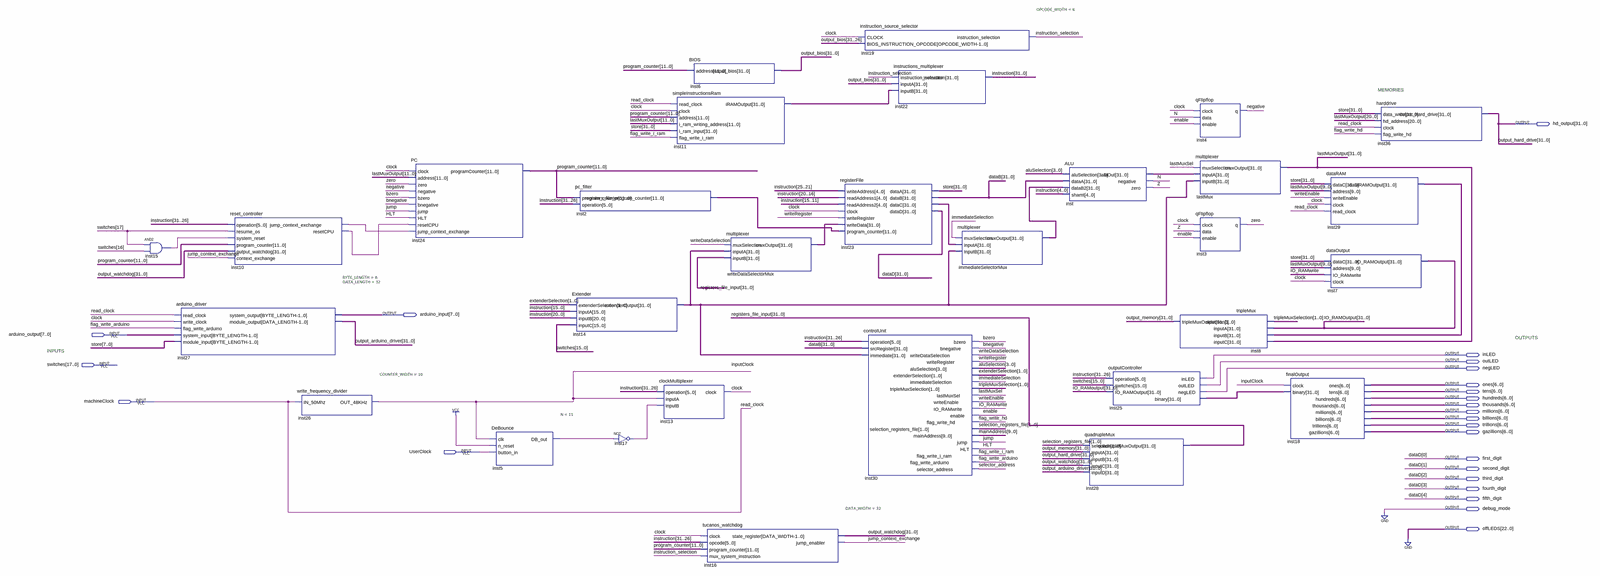
[diagram p0: schematic sheet, whole]
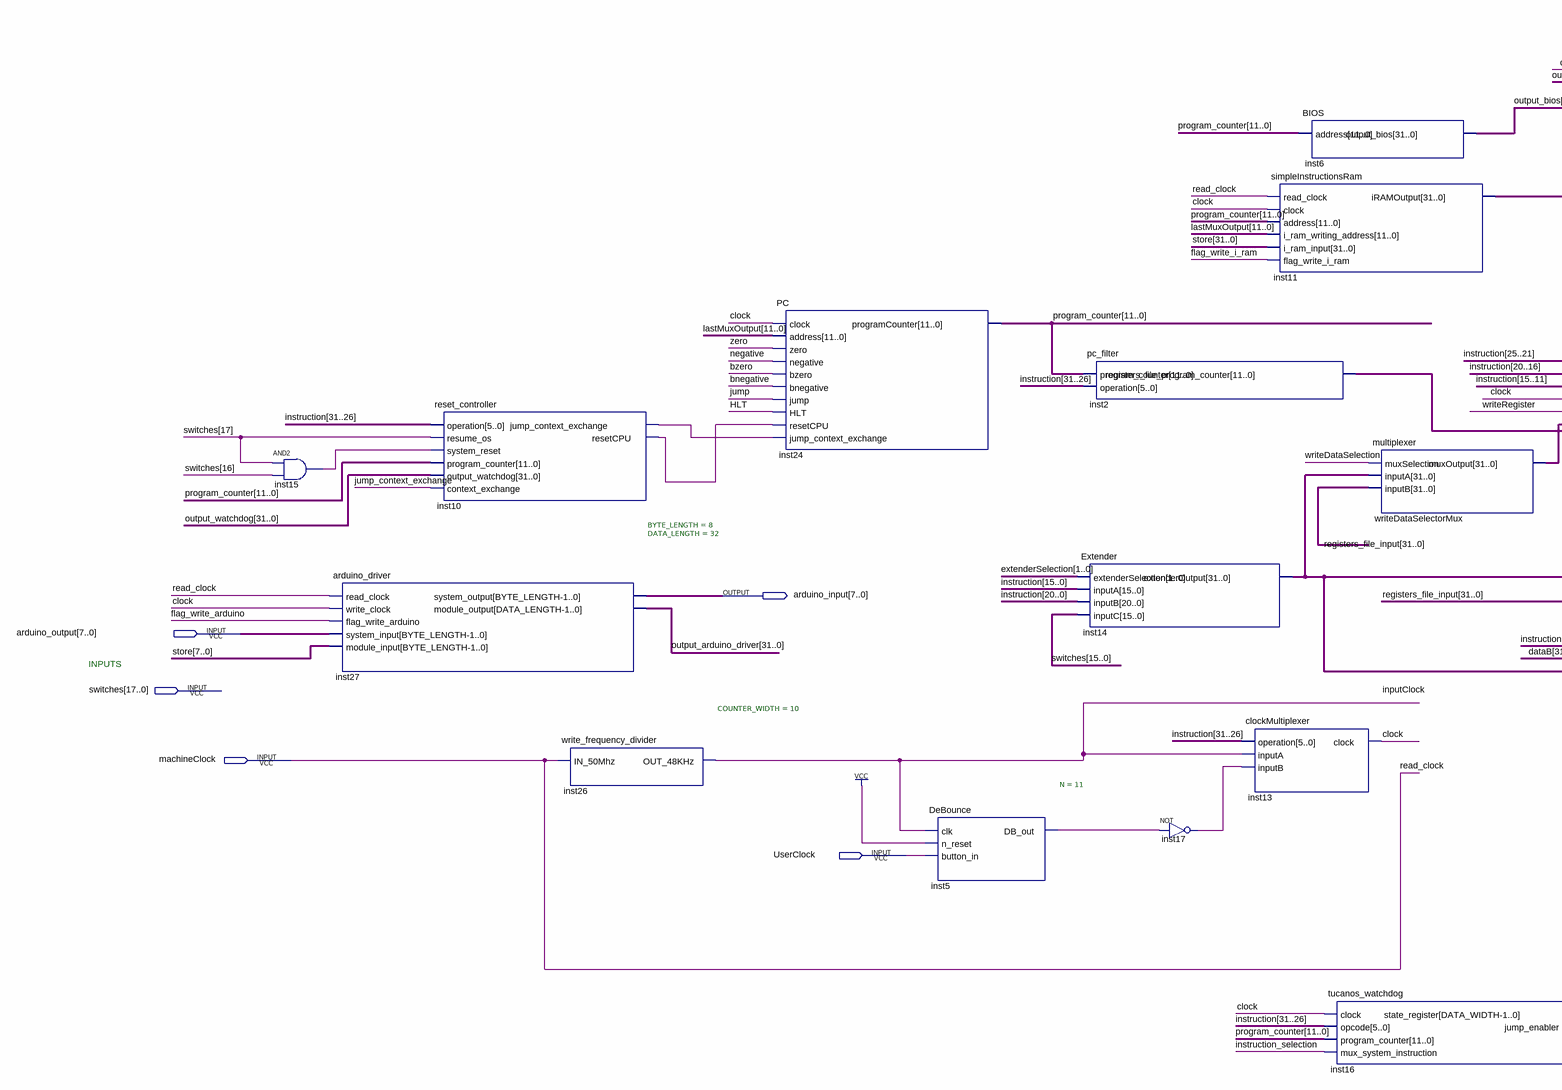
[diagram p1: schematic sheet, left part]
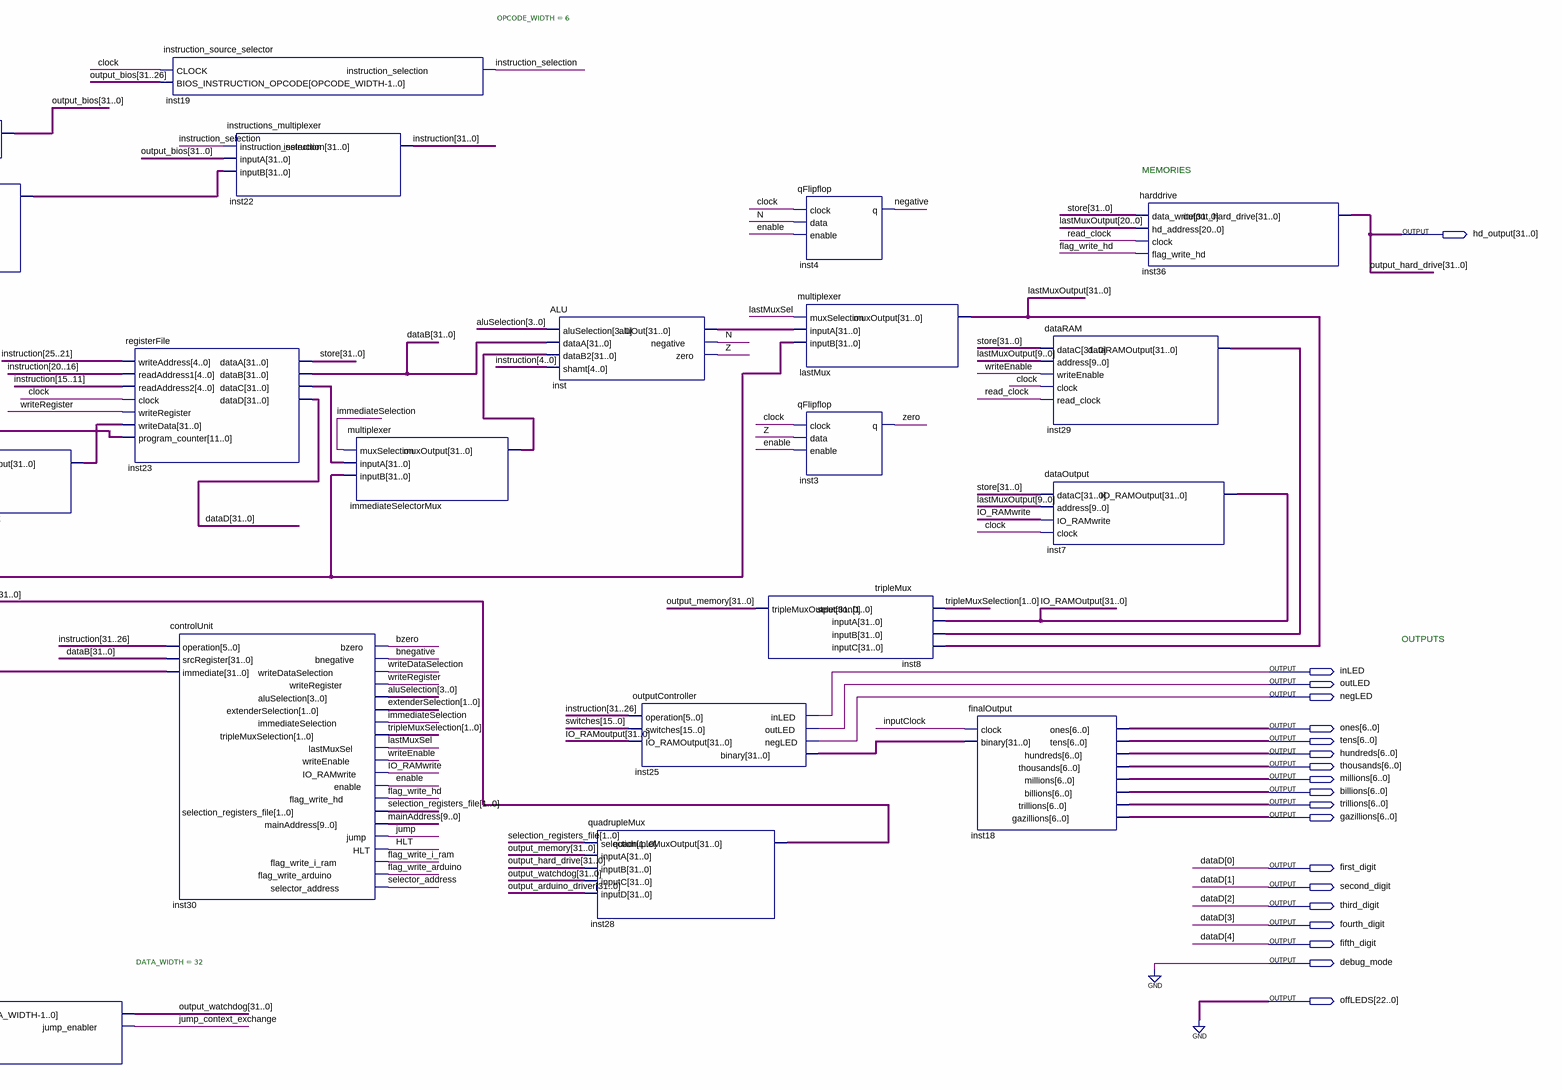
[diagram p2: schematic sheet, right part]
// Quartus schematic CPU.bdf as structural Verilog: 30 symbols, 24 pins
module CPU (
  input  [7:0] arduino_output,
  input  [17:0] switches,
  input  machineClock,
  input  UserClock,
  output [31:0] hd_output,
  output [7:0] arduino_input,
  output inLED,
  output outLED,
  output negLED,
  output [6:0] ones,
  output [6:0] tens,
  output [6:0] hundreds,
  output [6:0] thousands,
  output [6:0] millions,
  output [6:0] billions,
  output [6:0] trillions,
  output [6:0] gazillions,
  output first_digit,
  output second_digit,
  output third_digit,
  output fourth_digit,
  output fifth_digit,
  output debug_mode,
  output [22:0] offLEDS
);

  wire bnegative, bzero, clock, enable, flag_write_arduino, flag_write_hd, flag_write_i_ram, HLT,
       immediateSelection, inputClock, inst5_db_out, inst10_jump_context_exchange, inst10_resetcpu,
       inst15_out, inst17_out, instruction_selection, IO_RAMwrite, jump, jump_context_exchange, lastMuxSel,
       N, negative, selector_address, writeDataSelection, writeEnable, writeRegister, Z, zero;
  wire [1:0] extenderSelection, selection_registers_file, tripleMuxSelection;
  wire [3:0] aluSelection;
  wire [9:0] mainAddress;
  wire [11:0] inst2_registers_file_program_counter, program_counter;
  wire [31:0] dataB, immediateSelectorMux_muxoutput, inst11_iramoutput, inst14_extenderoutput, inst23_datac,
       inst25_binary, inst29_dataramoutput, inst_aluout, instruction, IO_RAMOutput, lastMuxOutput,
       output_arduino_driver, output_bios, output_memory, output_watchdog, registers_file_input, store,
       writeDataSelectorMux_muxoutput;
  wire [31:5] dataD;

  and inst15 (inst15_out, switches[17], switches[16]);
  arduino_driver #(.BYTE_LENGTH(8), .DATA_LENGTH(32)) inst27 (
    .read_clock(machineClock), .write_clock(clock), .flag_write_arduino(flag_write_arduino),
    .system_input(arduino_output), .module_input(store[7:0]), .system_output(arduino_input),
    .module_output(output_arduino_driver));
  reset_controller inst10 (
    .operation(instruction[31:26]), .resume_os(switches[17]), .system_reset(inst15_out),
    .program_counter(program_counter), .output_watchdog(output_watchdog),
    .context_exchange(jump_context_exchange), .jump_context_exchange(inst10_jump_context_exchange),
    .resetCPU(inst10_resetcpu));
  write_frequency_divider #(.COUNTER_WIDTH(10)) inst26 (.IN_50Mhz(machineClock), .OUT_48KHz(inputClock));
  PC inst24 (
    .clock(clock), .address(lastMuxOutput[11:0]), .zero(zero), .negative(negative), .bzero(bzero),
    .bnegative(bnegative), .jump(jump), .HLT(HLT), .resetCPU(inst10_resetcpu),
    .jump_context_exchange(inst10_jump_context_exchange), .programCounter(program_counter));
  DeBounce #(.N(11)) inst5 (.clk(inputClock), .n_reset(1'b1), .button_in(UserClock), .DB_out(inst5_db_out));
  pc_filter inst2 (
    .program_counter(program_counter), .operation(instruction[31:26]),
    .registers_file_program_counter(inst2_registers_file_program_counter));
  Extender inst14 (
    .extenderSelection(extenderSelection), .inputA(instruction[15:0]), .inputB(instruction[20:0]),
    .inputC(switches[15:0]), .extenderOutput(inst14_extenderoutput));
  not inst17 (inst17_out, inst5_db_out);
  clockMultiplexer inst13 (.operation(instruction[31:26]), .inputA(inputClock), .inputB(inst17_out), .clock(clock));
  BIOS inst6 (.address(program_counter), .output_bios(output_bios));
  simpleInstructionsRam inst11 (
    .read_clock(machineClock), .clock(clock), .address(program_counter),
    .i_ram_writing_address(lastMuxOutput[11:0]), .i_ram_input(store), .flag_write_i_ram(flag_write_i_ram),
    .iRAMOutput(inst11_iramoutput));
  tucanos_watchdog #(.DATA_WIDTH(32)) inst16 (
    .clock(clock), .opcode(instruction[31:26]), .program_counter(program_counter),
    .mux_system_instruction(instruction_selection), .state_register(output_watchdog),
    .jump_enabler(jump_context_exchange));
  multiplexer writeDataSelectorMux (
    .muxSelection(writeDataSelection), .inputA(inst14_extenderoutput), .inputB(registers_file_input),
    .muxOutput(writeDataSelectorMux_muxoutput));
  registerFile inst23 (
    .writeAddress(instruction[25:21]), .readAddress1(instruction[20:16]), .readAddress2(instruction[15:11]),
    .clock(clock), .writeRegister(writeRegister), .writeData(writeDataSelectorMux_muxoutput),
    .program_counter(inst2_registers_file_program_counter), .dataA(store), .dataB(dataB),
    .dataC(inst23_datac), .dataD({dataD, fifth_digit, fourth_digit, third_digit, second_digit, first_digit}));
  instruction_source_selector #(.OPCODE_WIDTH(6)) inst19 (
    .CLOCK(clock), .BIOS_INSTRUCTION_OPCODE(output_bios[31:26]), .instruction_selection(instruction_selection));
  controlUnit inst30 (
    .operation(instruction[31:26]), .srcRegister(dataB), .immediate(inst14_extenderoutput), .bzero(bzero),
    .bnegative(bnegative), .writeDataSelection(writeDataSelection), .writeRegister(writeRegister),
    .aluSelection(aluSelection), .extenderSelection(extenderSelection),
    .immediateSelection(immediateSelection), .tripleMuxSelection(tripleMuxSelection),
    .lastMuxSel(lastMuxSel), .writeEnable(writeEnable), .IO_RAMwrite(IO_RAMwrite), .enable(enable),
    .flag_write_hd(flag_write_hd), .selection_registers_file(selection_registers_file),
    .mainAddress(mainAddress), .jump(jump), .HLT(HLT), .flag_write_i_ram(flag_write_i_ram),
    .flag_write_arduino(flag_write_arduino), .selector_address(selector_address));
  instructions_multiplexer inst22 (
    .instruction_selection(instruction_selection), .inputA(output_bios), .inputB(inst11_iramoutput),
    .instruction(instruction));
  multiplexer immediateSelectorMux (
    .muxSelection(immediateSelection), .inputA(inst23_datac), .inputB(inst14_extenderoutput),
    .muxOutput(immediateSelectorMux_muxoutput));
  ALU inst (
    .aluSelection(aluSelection), .dataA(dataB), .dataB2(immediateSelectorMux_muxoutput),
    .shamt(instruction[4:0]), .aluOut(inst_aluout), .negative(N), .zero(Z));
  quadrupleMux inst28 (
    .selection(selection_registers_file), .inputA(output_memory), .inputB(hd_output),
    .inputC(output_watchdog), .inputD(output_arduino_driver), .quadrupleMuxOutput(registers_file_input));
  outputController inst25 (
    .operation(instruction[31:26]), .switches(switches[15:0]), .IO_RAMOutput(IO_RAMOutput), .inLED(inLED),
    .outLED(outLED), .negLED(negLED), .binary(inst25_binary));
  tripleMux inst8 (
    .selection(tripleMuxSelection), .inputA(IO_RAMOutput), .inputB(inst29_dataramoutput),
    .inputC(lastMuxOutput), .tripleMuxOutput(output_memory));
  qFlipflop inst4 (.clock(clock), .data(N), .enable(enable), .q(negative));
  multiplexer lastMux (
    .muxSelection(lastMuxSel), .inputA(inst_aluout), .inputB(inst14_extenderoutput), .muxOutput(lastMuxOutput));
  qFlipflop inst3 (.clock(clock), .data(Z), .enable(enable), .q(zero));
  finalOutput inst18 (
    .clock(inputClock), .binary(inst25_binary), .ones(ones), .tens(tens), .hundreds(hundreds),
    .thousands(thousands), .millions(millions), .billions(billions), .trillions(trillions),
    .gazillions(gazillions));
  dataRAM inst29 (
    .dataC(store), .address(lastMuxOutput[9:0]), .writeEnable(writeEnable), .clock(clock),
    .read_clock(machineClock), .dataRAMOutput(inst29_dataramoutput));
  dataOutput inst7 (
    .dataC(store), .address(lastMuxOutput[9:0]), .IO_RAMwrite(IO_RAMwrite), .clock(clock),
    .IO_RAMOutput(IO_RAMOutput));
  harddrive inst36 (
    .data_write(store), .hd_address(lastMuxOutput[20:0]), .clock(machineClock),
    .flag_write_hd(flag_write_hd), .output_hard_drive(hd_output));

  assign debug_mode = 1'b0;
  assign offLEDS = {23{1'b0}};

  // Other names for the same wires on the sheet: dataD[4:0] = {fifth_digit, fourth_digit, third_digit, second_digit, first_digit};
  //   output_hard_drive[31:0] = hd_output; read_clock = machineClock

  // Notes on the sheet:
  //   MEMORIES
  //   OUTPUTS
  //   INPUTS
endmodule
